# Altium schematic sheet ZOWI_Main_Board_Multiplexer.SchDoc: Multiplexer
size A4; Author: Raúl de Pablos; CompanyName: bq - Mundo Reader; Organization: bq - Mundo Reader; DocumentNumber: 9; Revision: 1.0; SheetNumber: 9; SheetTotal: 9; ProjectName: ZOWI_Main_Board
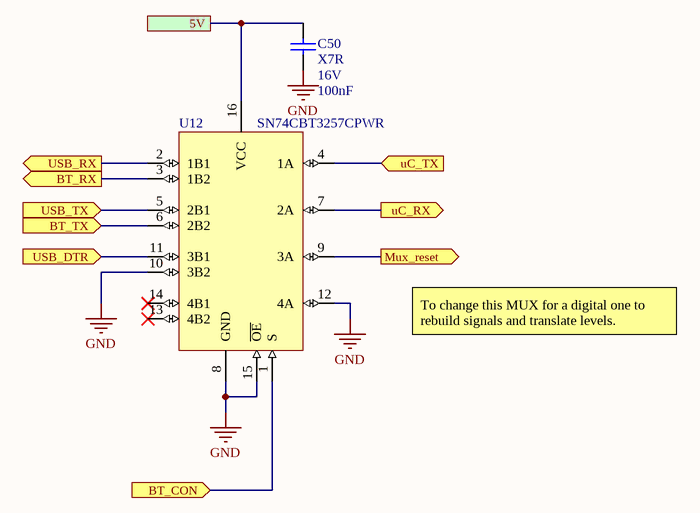
[diagram p0: ZOWI_Main_Board_Multiplexer.SchDoc]

## Parts
C50  Dielectric: X7R  Voltage: 16V  Capacitance: 100nF  [C0402]  (hidden comment: Capacitor)
U12  SN74CBT3257CPWR  [TSSOP16]

## Ports
5V, BT_CON (in), BT_RX (out), BT_TX (in), Mux_reset (out), uC_RX (out), uC_TX (in), USB_DTR (in), USB_RX (out), USB_TX (in)

## Nets
GND: C50.1 U12.8(GND) U12.10(3B2) U12.12(4A) U12.15(~{OE})
5V: C50.2 U12.16(VCC) ; port 5V
BT_CON: U12.1(S) ; port BT_CON
BT_RX: U12.3(1B2) ; port BT_RX
BT_TX: U12.6(2B2) ; port BT_TX
Mux_reset: U12.9(3A) ; port Mux_reset
uC_RX: U12.7(2A) ; port uC_RX
uC_TX: U12.4(1A) ; port uC_TX
USB_DTR: U12.11(3B1) ; port USB_DTR
USB_RX: U12.2(1B1) ; port USB_RX
USB_TX: U12.5(2B1) ; port USB_TX

Not connected (* = marked no-connect by the designer): U12 13(4B2)* 14(4B1)*

## Notes on the sheet
- To change this MUX for a digital one to rebuild signals and translate levels.
- Title
- Project
- Size:
- Author
- A4
- Number:
- Revision:
- Mundo Reader, S.L. All rights reserved. No part of these pages, either text or image may be used for any purpose other than personal use. Therefore, reproduction, modification, storage in a retrieval system or retransmission, in any form or by any means, electronic, mechanical or otherwise, for reasons other than personal use, is strictly prohibited without prior written permission.
- Date:
- Time:
- Sheet
- of

## Library data of the parts
C50 = C0402_100nF_16V_±10%: Capacitor SMD; Manufacturer: Kemet; Value: 100nF ±10% 16V; Tolerance: ±10%; OrderingCode: C0402C104K4RAC; Temp_ Max: 125; Temp_ Min: -55; Part Number: C0402_100nF_16V_±10%
U12 = SN74CBT3257CP: Multiplexer/demultiplexer Quad; Manufacturer: Texas Instruments; Temp_ Max: 85; Temp_ Min: -40; Part Number: SN74CBT3257CP; OrderingCode: SN74CBT3257CPWR